# Altium schematic sheet channel_2.SchDoc
size A3; SheetNumber: 10; SheetTotal: 12
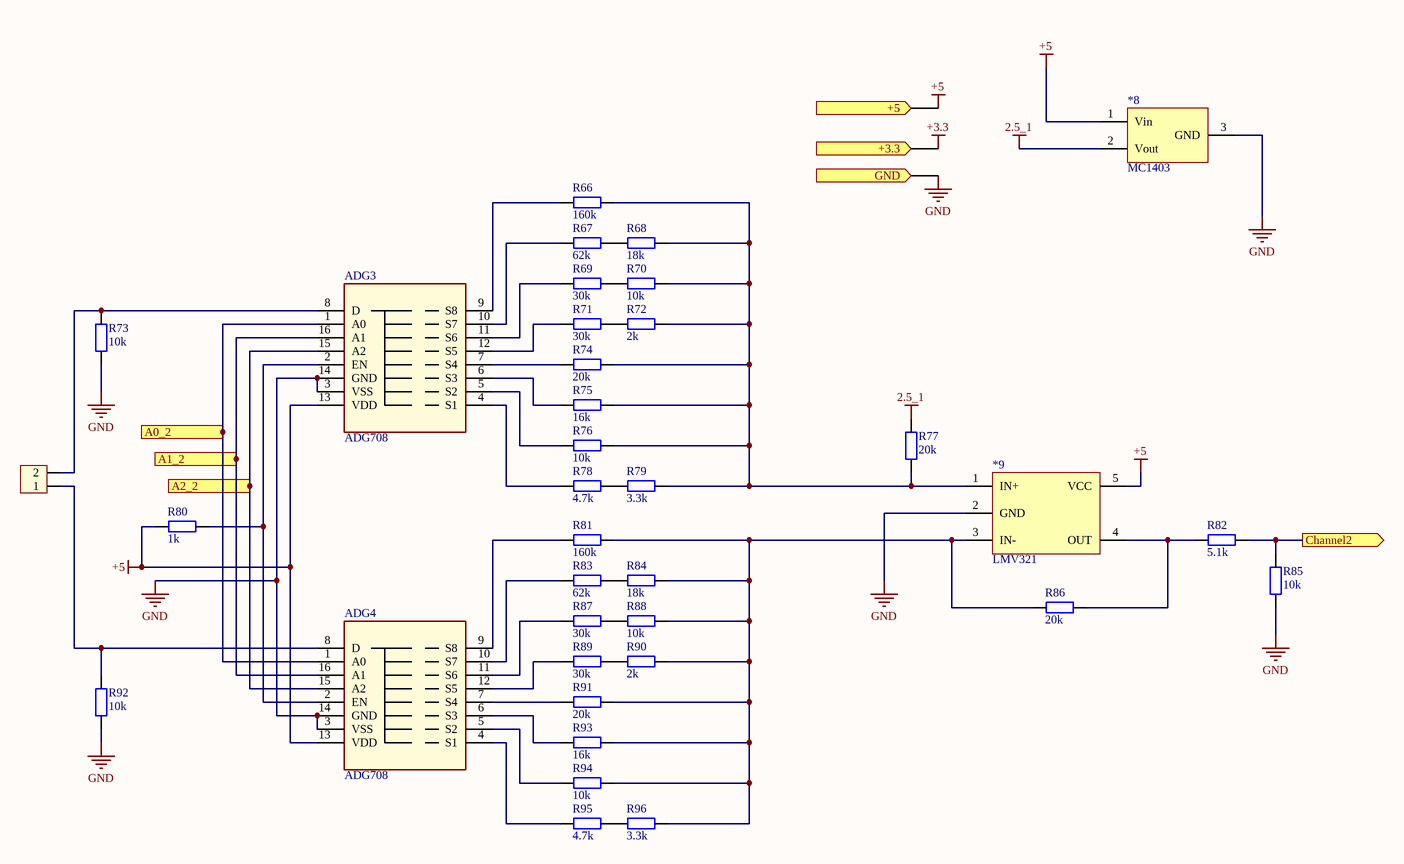
[diagram p0: channel_2.SchDoc]

## Parts
*8  MC1403  [dip8]
*9  LMV321  [SOT23-5]
ADG3  ADG708  [TSSOP16]
ADG4  ADG708  [TSSOP16]
H2  Header 2P 2.54 Duc Thang  [15EDGR-3.81-2P]  (value not drawn)
R66  160k  [tro smd 0603]
R67  62k  [tro smd 0603]
R68  18k  [tro smd 0603]
R69  30k  [tro smd 0603]
R70  10k  [tro smd 0603]
R71  30k  [tro smd 0603]
R72  2k  [tro smd 0603]
R73  10k  [tro smd 0603]
R74  20k  [tro smd 0603]
R75  16k  [tro smd 0603]
R76  10k  [tro smd 0603]
R77  20k  [tro smd 0603]
R78  4.7k  [tro smd 0603]
R79  3.3k  [tro smd 0603]
R80  1k  [tro smd 0603]
R81  160k  [tro smd 0603]
R82  5.1k  [tro smd 0603]
R83  62k  [tro smd 0603]
R84  18k  [tro smd 0603]
R85  10k  [tro smd 0603]
R86  20k  [tro smd 0603]
R87  30k  [tro smd 0603]
R88  10k  [tro smd 0603]
R89  30k  [tro smd 0603]
R90  2k  [tro smd 0603]
R91  20k  [tro smd 0603]
R92  10k  [tro smd 0603]
R93  16k  [tro smd 0603]
R94  10k  [tro smd 0603]
R95  4.7k  [tro smd 0603]
R96  3.3k  [tro smd 0603]

## Ports
+3.3 (in), +5 (in), A0_2 (in), A1_2 (in), A2_2 (in), Channel2 (out), GND (in)

## Nets
2.5_1: *8.2(Vout) R77.2
+3.3: port +3.3
+5: *8.1(Vin) *9.5(VCC) ADG3.13(VDD) ADG4.13(VDD) R80.2 ; port +5
GND: *8.3(GND) *9.2(GND) ADG3.3(VSS) ADG3.14(GND) ADG4.3(VSS) ADG4.14(GND) R73.2 R85.1 R92.2 ; port GND
A0_2: ADG3.1(A0) ADG4.1(A0) ; port A0_2
A1_2: ADG3.16(A1) ADG4.16(A1) ; port A1_2
A2_2: ADG3.15(A2) ADG4.15(A2) ; port A2_2
Channel2: R82.2 R85.2 ; port Channel2
Net*9_1: *9.1(IN+) R66.2 R68.2 R70.2 R72.2 R74.2 R75.2 R76.2 R77.1 R79.2
Net*9_3: *9.3(IN-) R81.2 R84.2 R86.1 R88.2 R90.2 R91.2 R93.2 R94.2 R96.2
Net*9_4: *9.4(OUT) R82.1 R86.2
NetADG3_2: ADG3.2(EN) ADG4.2(EN) R80.1
NetADG3_4: ADG3.4(S1) R78.1
NetADG3_5: ADG3.5(S2) R76.1
NetADG3_6: ADG3.6(S3) R75.1
NetADG3_7: ADG3.7(S4) R74.1
NetADG3_8: ADG3.8(D) H2.2 R73.1
NetADG3_9: ADG3.9(S8) R66.1
NetADG3_10: ADG3.10(S7) R67.1
NetADG3_11: ADG3.11(S6) R69.1
NetADG3_12: ADG3.12(S5) R71.1
NetADG4_4: ADG4.4(S1) R95.1
NetADG4_5: ADG4.5(S2) R94.1
NetADG4_6: ADG4.6(S3) R93.1
NetADG4_7: ADG4.7(S4) R91.1
NetADG4_8: ADG4.8(D) H2.1 R92.1
NetADG4_9: ADG4.9(S8) R81.1
NetADG4_10: ADG4.10(S7) R83.1
NetADG4_11: ADG4.11(S6) R87.1
NetADG4_12: ADG4.12(S5) R89.1
NetR67_2: R67.2 R68.1
NetR69_2: R69.2 R70.1
NetR71_2: R71.2 R72.1
NetR78_2: R78.2 R79.1
NetR83_2: R83.2 R84.1
NetR87_2: R87.2 R88.1
NetR89_2: R89.2 R90.1
NetR95_2: R95.2 R96.1

## Library data of the parts
H2 = Header 2P 2.54 Duc Thang: Cắm; Ten_Linh_Kien: Header 2P XH2.54-2P Đực Thẳng; Don_Vi: Con; Ma_Hang: MH001283; Chung_Loai: Cắm
R66-R81 R83 R84 R86-R96 = Tro 2512 5% 100k: Dán; Don_Vi: Con; So_Chan: 2; Ten_Linh_Kien: Trở 2512 5% 104-100k 1W; Ma_Hang: MH001941; Chung_Loai: Dán; Kieu_Chan: *
R82 R85 = Tro 0603 1% 10k: Dán; Don_Vi: Con; So_Chan: 2; Ten_Linh_Kien: Trở 0603 1% 10k; Ma_Hang: MH006333; Chung_Loai: Dán; Kieu_Chan: *